# EAGLE design Datalore-IP-m4-rev02 (EAGLE 9.2.2)
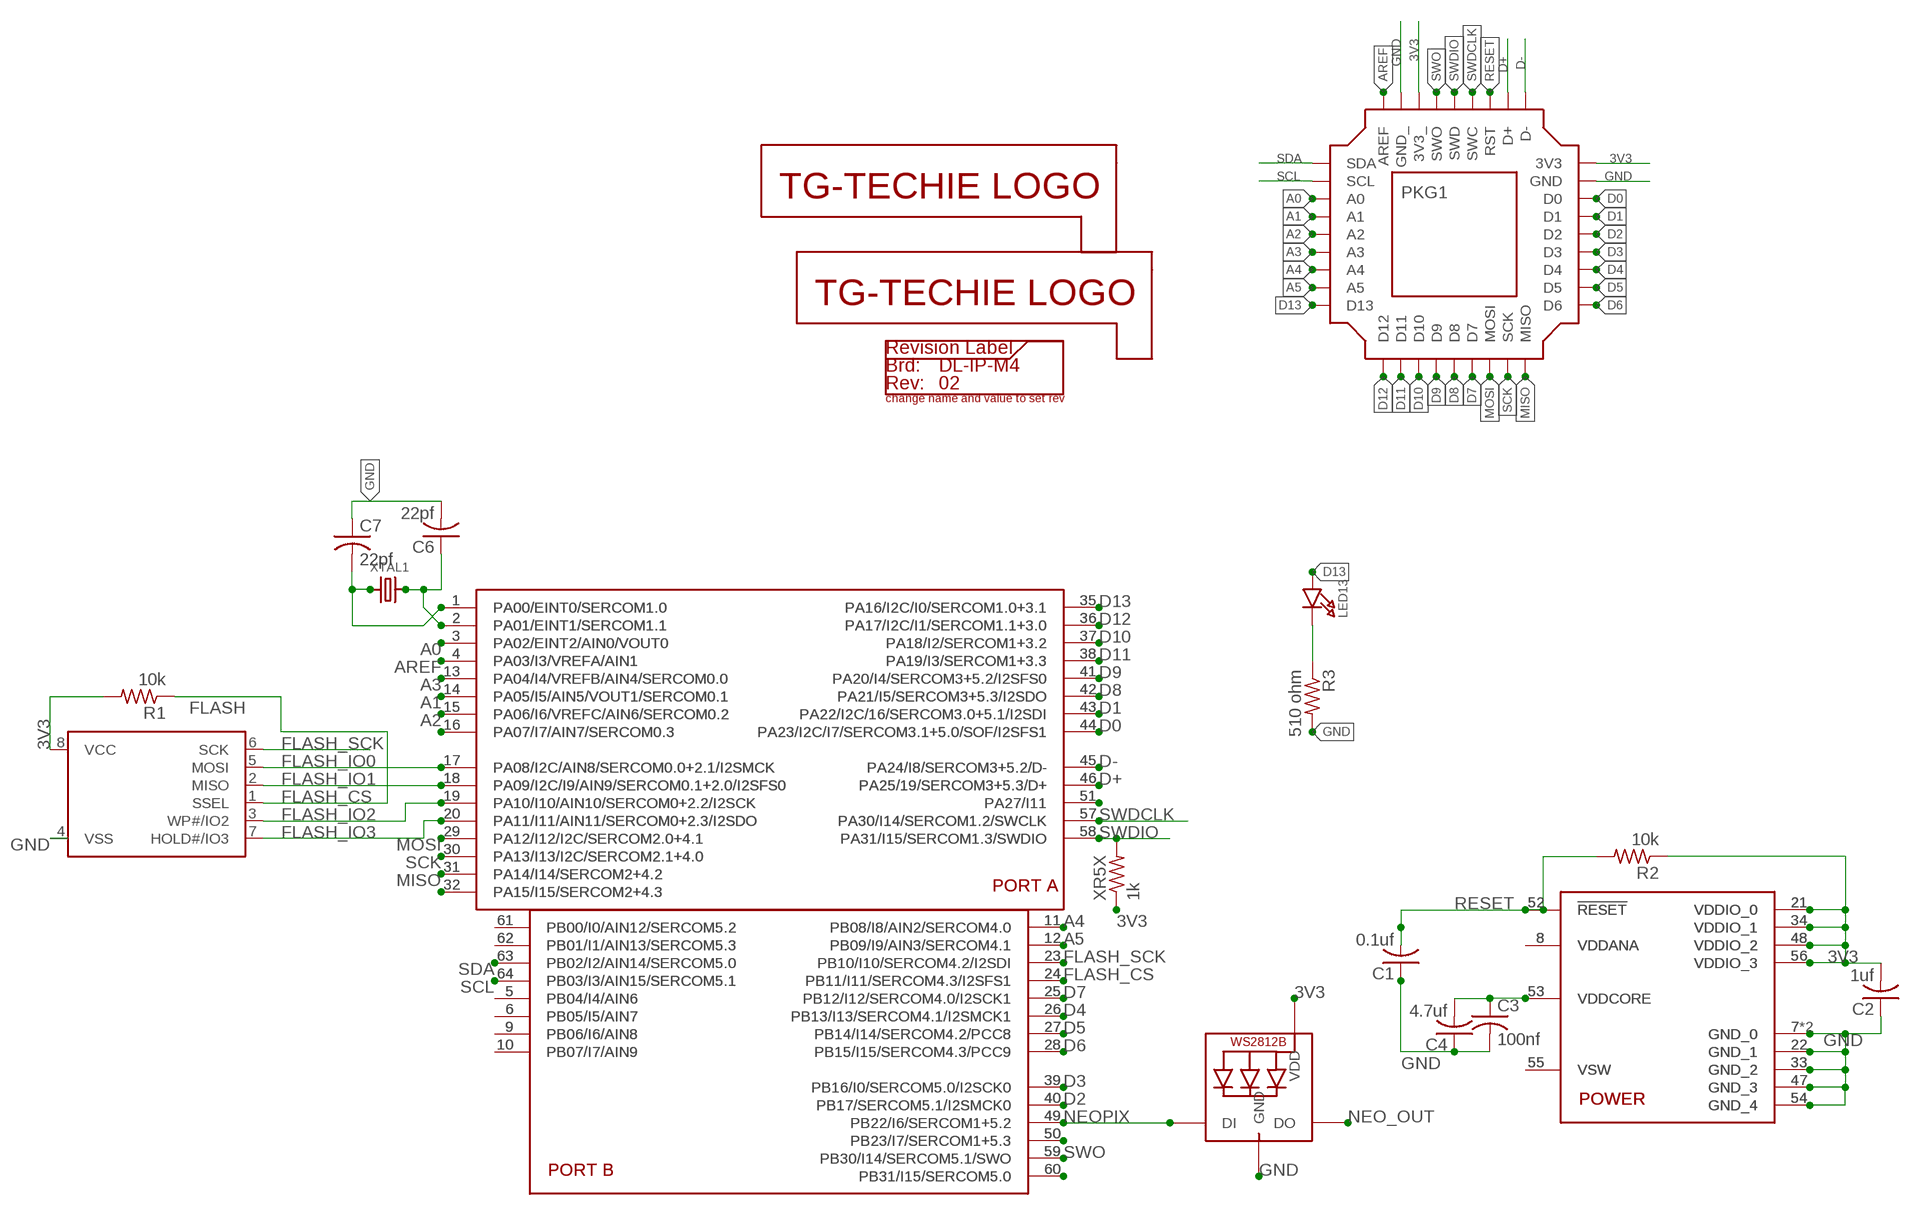
[diagram p0: schematic, sheet 1]

## Parts
..  MCU-ATSAMD51J-ADA+TG_TQFP  [QFP50P1200X1200X120-64N]
C1  0.1uf  C-TG_0603  [TG-0603]
C2  1uf  C-TG_0603  [TG-0603]
C3  100nf  C-TG_0603  [TG-0603]
C4  4.7uf  C-TG_0603  [TG-0603]
C6  22pf  C-TG_0603  [TG-0603]
C7  22pf  C-TG_0603  [TG-0603]
DL-IP-M4  02  REVISION_LABEL  [REVISION_LABEL]
FLASH  FLASH-SPI-CIRCUIT_PYTHON150MIL  [SOIC8_150MIL]
LED1  LED-NEO-WS2812B3535  [LED3535]
LED13  LED-MICROBUILDER1206_NOOUTLINE  [MICROBUILDER_CHIPLED_1206_NOOUTLINE]
PKG1  DATALORE_IP_M4PACKAGE  [DL_IP_36-100MIL-PACKAGE]
R1  10k  R_TG_0603  [TG-0603]
R2  10k  R_TG_0603  [TG-0603]
R3  510 ohm  R_TG_0603  [TG-0603]
U$1  LOGO-TG_TECHIEBIG?  [LOGO_TG_TEST_LARGE]
U$3  MCU-ATSAMD51J-ADA+TG_QFP_ADA  [MICROBUILDER_PQFN64-1]
U$5  LOGO-TG_TECHIEBIG?  [LOGO_TG_TEST_LARGE]
XR5X  1k  R_TG_0603  [TG-0603]
XTAL1  XTAL_ADA4.9X1.8  [MICROBUILDER_CRYSTAL_4.9X1.8]

## Nets
3V3: ...21(VDDIO_0) ...34(VDDIO_1) ...48(VDDIO_2) ...56(VDDIO_3) C2.2 FLASH.8(VCC) LED1.2(VDD) PKG1.3(3V3_) PKG1.10(3V3) R1.2 R2.1 U$3.21(VDDIO_0) U$3.34(VDDIO_1) U$3.48(VDDIO_2) U$3.56(VDDIO_3) XR5X.1
A0: ...3(PA02/EINT2/AIN0/VOUT0) PKG1.34(A0) U$3.3(PA02/EINT2/AIN0/VOUT0)
A1: ...14(PA05/I5/AIN5/VOUT1/SERCOM0.1) PKG1.33(A1) U$3.14(PA05/I5/AIN5/VOUT1/SERCOM0.1)
A2: ...15(PA06/I6/VREFC/AIN6/SERCOM0.2) PKG1.32(A2) U$3.15(PA06/I6/VREFC/AIN6/SERCOM0.2)
A3: ...13(PA04/I4/VREFB/AIN4/SERCOM0.0) PKG1.31(A3) U$3.13(PA04/I4/VREFB/AIN4/SERCOM0.0)
A4: ...11(PB08/I8/AIN2/SERCOM4.0) PKG1.30(A4) U$3.11(PB08/I8/AIN2/SERCOM4.0)
A5: ...12(PB09/I9/AIN3/SERCOM4.1) PKG1.29(A5) U$3.12(PB09/I9/AIN3/SERCOM4.1)
AREF: ...4(PA03/I3/VREFA/AIN1) PKG1.1(AREF) U$3.4(PA03/I3/VREFA/AIN1)
D0: ...44(PA23/I2C/I7/SERCOM3.1+5.0/SOF/I2SFS1) PKG1.12(D0) U$3.44(PA23/I2C/I7/SERCOM3.1+5.0/SOF/I2SFS1)
D1: ...43(PA22/I2C/16/SERCOM3.0+5.1/I2SDI) PKG1.13(D1) U$3.43(PA22/I2C/16/SERCOM3.0+5.1/I2SDI)
D2: ...40(PB17/SERCOM5.1/I2SMCK0) PKG1.14(D2) U$3.40(PB17/SERCOM5.1/I2SMCK0)
D3: ...39(PB16/I0/SERCOM5.0/I2SCK0) PKG1.15(D3) U$3.39(PB16/I0/SERCOM5.0/I2SCK0)
D4: ...26(PB13/I13/SERCOM4.1/I2SMCK1) PKG1.16(D4) U$3.26(PB13/I13/SERCOM4.1/I2SMCK1)
D5: ...27(PB14/I14/SERCOM4.2/PCC8) PKG1.17(D5) U$3.27(PB14/I14/SERCOM4.2/PCC8)
D6: ...28(PB15/I15/SERCOM4.3/PCC9) PKG1.18(D6) U$3.28(PB15/I15/SERCOM4.3/PCC9)
D7: ...25(PB12/I12/SERCOM4.0/I2SCK1) PKG1.22(D7) U$3.25(PB12/I12/SERCOM4.0/I2SCK1)
D8: ...42(PA21/I5/SERCOM3+5.3/I2SDO) PKG1.23(D8) U$3.42(PA21/I5/SERCOM3+5.3/I2SDO)
D9: ...41(PA20/I4/SERCOM3+5.2/I2SFS0) PKG1.24(D9) U$3.41(PA20/I4/SERCOM3+5.2/I2SFS0)
D10: ...37(PA18/I2/SERCOM1+3.2) PKG1.25(D10) U$3.37(PA18/I2/SERCOM1+3.2)
D11: ...38(PA19/I3/SERCOM1+3.3) PKG1.26(D11) U$3.38(PA19/I3/SERCOM1+3.3)
D12: ...36(PA17/I2C/I1/SERCOM1.1+3.0) PKG1.27(D12) U$3.36(PA17/I2C/I1/SERCOM1.1+3.0)
D13: ...35(PA16/I2C/I0/SERCOM1.0+3.1) LED13.A PKG1.28(D13) U$3.35(PA16/I2C/I0/SERCOM1.0+3.1)
D+: ...46(PA25/19/SERCOM3+5.3/D+) PKG1.8(D+) U$3.46(PA25/19/SERCOM3+5.3/D+)
D-: ...45(PA24/I8/SERCOM3+5.2/D-) PKG1.9(D-) U$3.45(PA24/I8/SERCOM3+5.2/D-)
FLASH_CS: ...24(PB11/I11/SERCOM4.3/I2SFS1) FLASH.1(SSEL) R1.1 U$3.24(PB11/I11/SERCOM4.3/I2SFS1)
FLASH_IO0: ...17(PA08/I2C/AIN8/SERCOM0.0+2.1/I2SMCK) FLASH.5(MOSI) U$3.17(PA08/I2C/AIN8/SERCOM0.0+2.1/I2SMCK)
FLASH_IO1: ...18(PA09/I2C/I9/AIN9/SERCOM0.1+2.0/I2SFS0) FLASH.2(MISO) U$3.18(PA09/I2C/I9/AIN9/SERCOM0.1+2.0/I2SFS0)
FLASH_IO2: ...19(PA10/I10/AIN10/SERCOM0+2.2/I2SCK) FLASH.3(WP#/IO2) U$3.19(PA10/I10/AIN10/SERCOM0+2.2/I2SCK)
FLASH_IO3: ...20(PA11/I11/AIN11/SERCOM0+2.3/I2SDO) FLASH.7(HOLD#/IO3) U$3.20(PA11/I11/AIN11/SERCOM0+2.3/I2SDO)
FLASH_SCK: ...23(PB10/I10/SERCOM4.2/I2SDI) FLASH.6(SCK) U$3.23(PB10/I10/SERCOM4.2/I2SDI)
GND: ...7(GND_0) ...22(GND_1) ...33(GND_2) ...47(GND_3) ...54(GND_4) C1.1 C2.1 C3.2 C4.1 C6.2 C7.1 FLASH.4(VSS) LED1.4(GND) PKG1.2(GND_) PKG1.11(GND) R3.2 U$3.7(GND_0) U$3.22(GND_1) U$3.33(GND_2) U$3.47(GND_3) U$3.54(GND_4) U$3.EXP(GND_0)
MISO: ...31(PA14/I14/SERCOM2+4.2) PKG1.19(MISO) U$3.31(PA14/I14/SERCOM2+4.2)
MOSI: ...29(PA12/I12/I2C/SERCOM2.0+4.1) PKG1.21(MOSI) U$3.29(PA12/I12/I2C/SERCOM2.0+4.1)
N$1: ...16(PA07/I7/AIN7/SERCOM0.3) U$3.16(PA07/I7/AIN7/SERCOM0.3)
N$2: ...32(PA15/I15/SERCOM2+4.3) U$3.32(PA15/I15/SERCOM2+4.3)
N$3: ...51(PA27/I11) U$3.51(PA27/I11)
N$4: LED13.C R3.1
N$5: ...8(VDDANA) U$3.8(VDDANA)
N$6: ...55(VSW) U$3.55(VSW)
N$7: ...61(PB00/I0/AIN12/SERCOM5.2) U$3.61(PB00/I0/AIN12/SERCOM5.2)
N$8: ...62(PB01/I1/AIN13/SERCOM5.3) U$3.62(PB01/I1/AIN13/SERCOM5.3)
N$9: ...5(PB04/I4/AIN6) U$3.5(PB04/I4/AIN6)
N$10: ...50(PB23/I7/SERCOM1+5.3) U$3.50(PB23/I7/SERCOM1+5.3)
N$11: ...60(PB31/I15/SERCOM5.0) U$3.60(PB31/I15/SERCOM5.0)
N$13: ...6(PB05/I5/AIN7) U$3.6(PB05/I5/AIN7)
N$14: ...9(PB06/I6/AIN8) U$3.9(PB06/I6/AIN8)
N$15: ...10(PB07/I7/AIN9) U$3.10(PB07/I7/AIN9)
NEO_OUT: LED1.3(DO)
NEOPIX: ...49(PB22/I6/SERCOM1+5.2) LED1.1(DI) U$3.49(PB22/I6/SERCOM1+5.2)
RESET: ...52(!RESET) C1.2 PKG1.7(RST) R2.2 U$3.52(!RESET)
SCK: ...30(PA13/I13/I2C/SERCOM2.1+4.0) PKG1.20(SCK) U$3.30(PA13/I13/I2C/SERCOM2.1+4.0)
SCL: ...64(PB03/I3/AIN15/SERCOM5.1) PKG1.35(SCL) U$3.64(PB03/I3/AIN15/SERCOM5.1)
SDA: ...63(PB02/I2/AIN14/SERCOM5.0) PKG1.36(SDA) U$3.63(PB02/I2/AIN14/SERCOM5.0)
SWDCLK: ...57(PA30/I14/SERCOM1.2/SWCLK) PKG1.6(SWC) U$3.57(PA30/I14/SERCOM1.2/SWCLK)
SWDIO: ...58(PA31/I15/SERCOM1.3/SWDIO) PKG1.5(SWD) U$3.58(PA31/I15/SERCOM1.3/SWDIO) XR5X.2
SWO: ...59(PB30/I14/SERCOM5.1/SWO) PKG1.4(SWO) U$3.59(PB30/I14/SERCOM5.1/SWO)
VCORE: ...53(VDDCORE) C3.1 C4.2 U$3.53(VDDCORE)
XTAL0: ...2(PA01/EINT1/SERCOM1.1) C6.1 U$3.2(PA01/EINT1/SERCOM1.1) XTAL1.2
XTAL1: ...1(PA00/EINT0/SERCOM1.0) C7.2 U$3.1(PA00/EINT0/SERCOM1.0) XTAL1.1

## Library data of the parts
.. U$3 = 0TG-Lib v01.4:MCU-ATSAMD51J-ADA+TG: ATSAMD51J cortex m4 microcontroller from: adafruit altered: TG-Techie
C1-C4 C6 C7 = 0TG-Lib v01.4:C-TG
DL-IP-M4 = 0TG-Lib v01.4:REVISION_LABEL
FLASH = 0TG-Lib v01.4:FLASH-SPI-CIRCUIT_PYTHON: SOIC8 SPI Flash Be careful with the size since SOIC8 flash comes in several 'widths' SOIC8 150 mil M25P16 - 16Mbit (2Mbit x 8) Serial Flash (75MHz SPI Bus), Supply: 2.7-3.6V Digikey: SOIC8 - M25P16-VMN6P-ND SOIC8 208 mil W25Q16BVSSIG - 16Mbit (2Mbit x 8) Serial Flash (104MHz SPI Bus), Supply: 2.7-3.6V Digikey: SOIC8 - W25Q16BVSSIG-ND from: adafruit availability low
LED1 = 0TG-Lib v01.3:LED-NEO-WS2812B: from: adafruit
LED13 = 0TG-Lib v01.4:LED-MICROBUILDER: from: microbuilder LED 0603 - 0603 Surface Mount Package 2mA: Green LED - Low Power (3.9mcd, 2ma, 1.7Vf) - Digikey: 475-2709-2-ND Orange LED - Low Power (9.8mcd, 2ma, 1.8Vf) - Digikey: 475-1194-2-ND Red LED - Low Power (5mcd, 2ma, 1.8Vf) - Digikey: 475-1195-2-ND Yellow LED - Low Power (7mcd, 2ma, 1.8Vf) - Digikey: 475-1196-2-ND 5mA: Blue LED - Low Power (17mcd, 5ma, 2.9Vf) - Digikey: LNJ937W8CRACT-ND 0805 - 0805 Surface Mount Package 2mA: Red LED (8.8mcd, 2mA, 1.8Vf, Clear) - Low Power [Digikey: 475-2510-1-ND] Green LED (5mcd, 2mA, 1.8Vf, Clear) - Low Power [Digikey: 475-2730-1-ND] Yellow LED (11.3mcd, 2mA, 1.8Vf, Clear) - Low Power [Digikey: 475-2555-1-ND] 20mA: Red LED (104mcd, 20mA, Diffused) - LS R976 [Digikey: 475-1278-6-ND] Red LED (12mcd, 20mA, 2.0Vf, Clear) - APT2012EC [Digikey: 754-1128-1-ND] Green LED (15mcd, 20mA, 2.2Vf, Clear) - APT2012GC [Digikey: 754-1131-1-ND] Orange LED (160mcd, 20mA, 2.1Vf, Clear) - APT2012SECK [Digikey: 754-1130-1-ND] 1206 - 1206 Surface Mount Package Green LED (26mcd, 20mA, Diffused) - LG N971 [Digikey: 475-1407-6-ND] Red LED (15mcd, 20mA, Diffused) - LH N974 [Digikey: 475-1416-6-ND] Cree - Cree High-Power Surface Mount LEDs XPEBWT-L1-0000-00D50 - White 111lm 350mA 2.9Vf 6200K 110° XTEAWT-00-0000-00000LEE3 - White 114lm 350mA 2.85Vf 5000K 115° Everlight - Everlight 45-21 Series Surface Mount LEDs 45-21/QK2C-B2832AC2CB2/2T - Warm White 2000mcd 20mA 3.25Vf 3050K 120° 45-21/LK2C-B38452C4CB2/2T - Nuetral White 2000mcd 20mA 3.25Vf 4150K 120° 45-21/LK2C-B50634C6CB2/2T - Cold White 2200mcd 20mA 3.25Vf 5650K 120° PLCC2 Reverse Mount LS T77K-J1L2-1-0-2-R18-Z - Red 11.25mcd 2mA 1.8Vf 630nm 120° LO T77K-L1M2-24-Z - Orange 19.6mcd 2mA 1.8Vf 606nm 120° LY T77K-K2M1-26-Z - Yellow 15.7mcd 2mA 1.8Vf 587nm 120°
PKG1 = Datalore dev lib:DATALORE_IP_M4
R1-R3 XR5X = 0TG-Lib v01.4:R_TG
U$1 U$5 = 0TG-Lib v01.4:LOGO-TG_TECHIE
XTAL1 = 0TG-Lib v01.4:XTAL_ADA: Crystals HC49UP - Surface Mount Crystal 4.0MHz 18pF +/-30ppm Surface Mount Crystal [Digikey: 535-9857-1-ND] 12.0 MHz Surface Mount Crystal [Digikey: 535-9869-6-ND] 25.0 MHz Surface Mount Crystal [Digikey: 535-9078-1-ND] 2.5 x 2.0mm - MEMs SMT Crystal 16.0 MHz 10pF 20ppm 2.5 x 2.0mm Crystal [Digikey -40-85°C: 535-10923-1-ND] 3.2 x 2.5mm - MEMs SMT Crystal 12.0 MHz 8pF 15ppm 3.2 x 2.5mm Crystal [Digikey: -10-70°C: 644-1047-1-ND -40-125°C: 644-1128-1-ND] 16.0 MHz 8pF 15ppm 3.2 x 2.5mm Crystal [Digikey: -10-70°C: 644-1049-1-ND -40-125°C: 644-1129-2-ND] 16.0 MHz 10pF 10ppm 3.2 x 2.5mm Crystal [Digikey: 644-1100-1-ND] 27.12 MHz 18pF 30ppm 3.2 x 2.5mm Crystal [Digikey: 887-1424-1-ND] 27.12MHz 10pF 10ppm 3.2 x 2.5mm Crystal [Digikey: 887-1329-1-ND] 4.9 x 1.8mm - MEMs SMT Crystal 32.768 KHz 12.5pF 20ppm 4.9 x 1.8mm Crystal [Digikey: SE2415CT-ND] 8.0 x 3.8mm - Surface Mount Crystal 32.768kHz 12.5pF 20ppm -40°C-85°C [Digikey: 535-9166-2-ND] Cylinder 32.768KHz Cylinder Crystal (2x6mm body) [Ex. Digikey: 300-8341-2-ND]

## Board
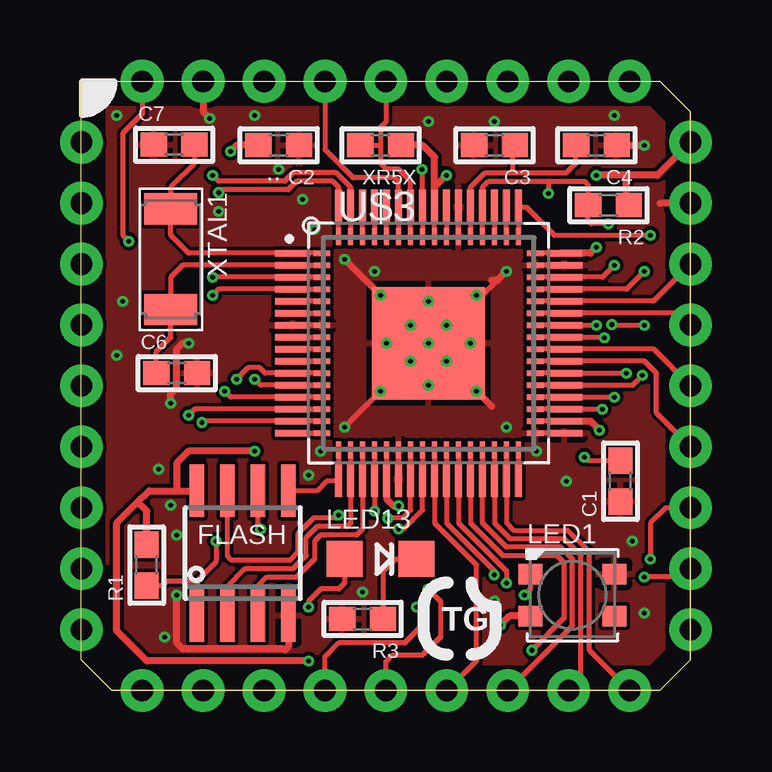
[diagram p1: board, top side]
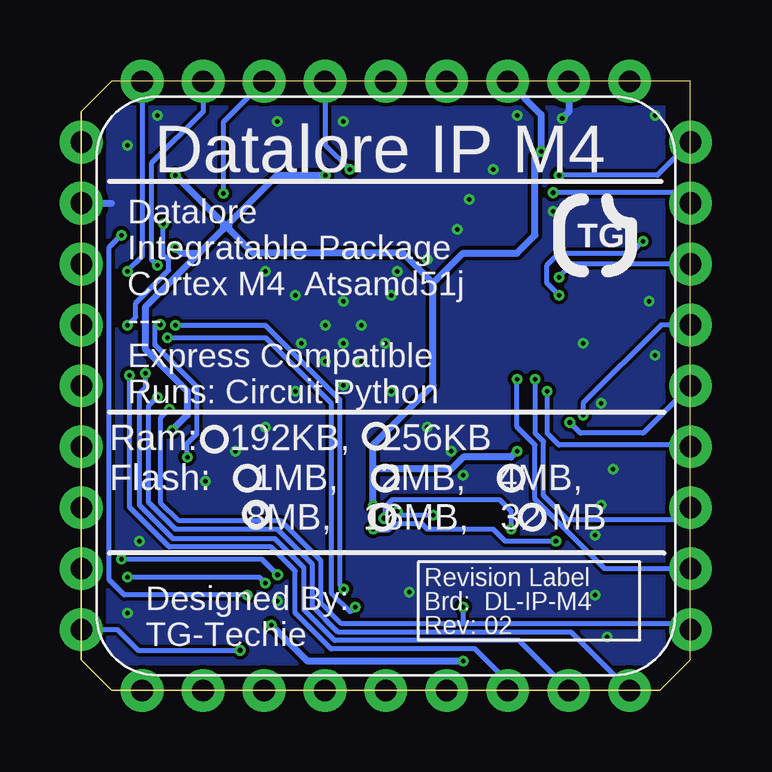
[diagram p2: board, bottom side, seen from below]

Size 25.4 x 25.4 mm. Coordinates in mm from the lower left corner, seen from the top.
Outline: 0,1.27 1.27,0 24.13,0 25.4,1.27 25.4,24.13 24.13,25.4
Copper layers (1*16): Top 0.035mm / dielectric 0.53mm / Bottom 0.035mm
Design rules "tg jlc-special via": minimum track width 0.195mm, minimum drill 0.2mm, track to track 6mil, track to pad 6mil, pad to pad 6mil, via to via 6mil, smd to smd 6mil, copper to edge 40mil, drill to drill 6mil, minimum pad ring 10mil, minimum via ring 0.125mm, stop-mask expansion 4mil, vias tented up to drill 10000mil, thermal gap 10mil

### Footprints (pad centres in the part's own frame; a part is rotated, then mirrored left to right if it is on the bottom)
QFP50P1200X1200X120-64N = smd 1.47 x 0.28: 1 -5.67,3.75; 2 -5.67,3.25; 3 -5.67,2.75; 4 -5.67,2.25; 5 -5.67,1.75; 6 -5.67,1.25; 7 -5.67,0.75; 8 -5.67,0.25; 9 -5.67,-0.25; 10 -5.67,-0.75; 11 -5.67,-1.25; 12 -5.67,-1.75; 13 -5.67,-2.25; 14 -5.67,-2.75; 15 -5.67,-3.25; 16 -5.67,-3.75; 33 5.67,-3.75; 34 5.67,-3.25; 35 5.67,-2.75; 36 5.67,-2.25; 37 5.67,-1.75; 38 5.67,-1.25; 39 5.67,-0.75; 40 5.67,-0.25; 41 5.67,0.25; 42 5.67,0.75; 43 5.67,1.25; 44 5.67,1.75; 45 5.67,2.25; 46 5.67,2.75; 47 5.67,3.25; 48 5.67,3.75 | smd 0.28 x 1.47: 17 -3.75,-5.67; 18 -3.25,-5.67; 19 -2.75,-5.67; 20 -2.25,-5.67; 21 -1.75,-5.67; 22 -1.25,-5.67; 23 -0.75,-5.67; 24 -0.25,-5.67; 25 0.25,-5.67; 26 0.75,-5.67; 27 1.25,-5.67; 28 1.75,-5.67; 29 2.25,-5.67; 30 2.75,-5.67; 31 3.25,-5.67; 32 3.75,-5.67; 49 3.75,5.67; 50 3.25,5.67; 51 2.75,5.67; 52 2.25,5.67; 53 1.75,5.67; 54 1.25,5.67; 55 0.75,5.67; 56 0.25,5.67; 57 -0.25,5.67; 58 -0.75,5.67; 59 -1.25,5.67; 60 -1.75,5.67; 61 -2.25,5.67; 62 -2.75,5.67; 63 -3.25,5.67; 64 -3.75,5.67
TG-0603 = smd 1.1 x 1: 1 -0.85,0; 2 0.85,0
SOIC8_150MIL = smd 0.6 x 2.2: 1 -1.905,-2.6; 2 -0.635,-2.6; 3 0.635,-2.6; 4 1.905,-2.6; 5 1.905,2.6; 6 0.635,2.6; 7 -0.635,2.6; 8 -1.905,2.6
LED3535 = smd 1 x 0.85: 1 -1.75,0.875; 2 -1.75,-0.875; 3 1.75,-0.875; 4 1.75,0.875
MICROBUILDER_CHIPLED_1206_NOOUTLINE = smd 1.5 x 1.5: A 0,-1.496; C 0,1.496
DL_IP_36-100MIL-PACKAGE = drill 0.9 pad 1.778: 1 -10.16,12.7; 2 -7.62,12.7; 3 -5.08,12.7; 4 -2.54,12.7; 5 0,12.7; 6 2.54,12.7; 7 5.08,12.7; 8 7.62,12.7; 9 10.16,12.7; 10 12.7,10.16; 11 12.7,7.62; 12 12.7,5.08; 13 12.7,2.54; 14 12.7,0; 15 12.7,-2.54; 16 12.7,-5.08; 17 12.7,-7.62; 18 12.7,-10.16; 19 10.16,-12.7; 20 7.62,-12.7; 21 5.08,-12.7; 22 2.54,-12.7; 23 0,-12.7; 24 -2.54,-12.7; 25 -5.08,-12.7; 26 -7.62,-12.7; 27 -10.16,-12.7; 28 -12.7,-10.16; 29 -12.7,-7.62; 30 -12.7,-5.08; 31 -12.7,-2.54; 32 -12.7,0; 33 -12.7,2.54; 34 -12.7,5.08; 35 -12.7,7.62; 36 -12.7,10.16
MICROBUILDER_PQFN64-1 = smd 0.7 x 0.22: 1 -4.45,3.75; 2 -4.45,3.25; 3 -4.45,2.75; 4 -4.45,2.25; 5 -4.45,1.75; 6 -4.45,1.25; 7 -4.45,0.75; 8 -4.45,0.25; 9 -4.45,-0.25; 10 -4.45,-0.75; 11 -4.45,-1.25; 12 -4.45,-1.75; 13 -4.45,-2.25; 14 -4.45,-2.75; 15 -4.45,-3.25; 16 -4.45,-3.75; 33 4.45,-3.75; 34 4.45,-3.25; 35 4.45,-2.75; 36 4.45,-2.25; 37 4.45,-1.75; 38 4.45,-1.25; 39 4.45,-0.75; 40 4.45,-0.25; 41 4.45,0.25; 42 4.45,0.75; 43 4.45,1.25; 44 4.45,1.75; 45 4.45,2.25; 46 4.45,2.75; 47 4.45,3.25; 48 4.45,3.75 | smd 0.22 x 0.7: 17 -3.75,-4.45; 18 -3.25,-4.45; 19 -2.75,-4.45; 20 -2.25,-4.45; 21 -1.75,-4.45; 22 -1.25,-4.45; 23 -0.75,-4.45; 24 -0.25,-4.45; 25 0.25,-4.45; 26 0.75,-4.45; 27 1.25,-4.45; 28 1.75,-4.45; 29 2.25,-4.45; 30 2.75,-4.45; 31 3.25,-4.45; 32 3.75,-4.45; 49 3.75,4.45; 50 3.25,4.45; 51 2.75,4.45; 52 2.25,4.45; 53 1.75,4.45; 54 1.25,4.45; 55 0.75,4.45; 56 0.25,4.45; 57 -0.25,4.45; 58 -0.75,4.45; 59 -1.25,4.45; 60 -1.75,4.45; 61 -2.25,4.45; 62 -2.75,4.45; 63 -3.25,4.45; 64 -3.75,4.45 | smd 4.7 x 4.7: EXP 0,0
MICROBUILDER_CRYSTAL_4.9X1.8 = smd 1.3 x 2.2: 1 -2.1,0; 2 2.1,0

### Placement (x,y rotation side)
..  14.48,14.48 0 top
C1  22.48,8.73 90 top
C2  8.23,22.73 180 top
C3  17.23,22.73 180 top
C4  21.48,22.73 180 top
C6  3.98,13.23 0 top
C7  3.87,22.75 0 top
DL-IP-M4  11.11,5.11 0 bottom
FLASH  6.73,5.73 0 top
LED1  20.48,3.98 0 top
LED13  12.48,5.48 270 top
PKG1  12.7,12.7 0 top
R1  2.73,5.23 90 top
R2  21.98,20.23 180 top
R3  11.73,2.98 180 top
U$1  3.98,17.48 0 bottom
U$3  14.48,14.48 0 top
U$5  15.77,1.5 0 top
XR5X  12.48,22.73 180 top
XTAL1  3.73,17.98 270 top

### Tracks (layer width: path | path; a pad name or v marks a point on that pad's centre or on a via)
3V3  (via drill 0.2 pad 0.12)
  Top 0.2: U$3.21 ...21 | ...48 19.98,18.23 U$3.48 | U$3.56 ...56 | ...34 U$3.34
  Top 0.3: ...34 21.23,11.23 v21.61,10.86 | ...21 12.73,7.98 13.01,7.7 v13.23,7.7 | LED1.2 17.86,3.1 v17.48,2.73 | v9.48,1.23 2.73,1.23 1.48,2.48 1.48,6.98 2.35,7.86 | 2.35,7.86 2.83,8.33 3.98,8.33 | ...56 14.73,20.98 | 14.73,20.98 v15.23,21.48 | 14.73,20.98 14.73,22.23 14.23,22.73 XR5X.1 | PKG1.10 24.02,21.48 22.73,21.48 | 22.73,21.48 v21.48,21.48 | R2.1 22.73,20.33 22.73,21.48 | C2.2 6.48,22.73 v6.23,22.48 | R1.2 2.73,7.48 2.35,7.86 | 3.98,8.33 FLASH.8 | v7.23,9.98 4.48,9.98 3.98,9.48 3.98,8.33 | v21.48,18.48 21.23,18.23 19.98,18.23
  Bottom 0.3: v21.61,10.86 20.98,11.48 20.98,12.48 22.73,14.23 22.73,15.98 20.48,18.23 | v17.48,2.73 15.98,1.23 v9.48,1.23 | v15.23,21.48 17.23,21.48 19.23,19.48 | 10.73,16.98 11.98,18.23 18.23,18.23 19.23,19.23 19.23,19.48 | 10.73,16.98 9.48,18.23 7.23,18.23 6.48,18.98 6.48,22.23 v6.23,22.48 6.23,24.01 PKG1.3 | v13.23,7.7 13.23,9.23 | 13.23,9.23 13.23,10.23 10.73,12.73 10.73,16.98 | 13.23,9.23 9.98,9.23 9.48,9.73 7.48,9.73 v7.23,9.98 | v21.48,18.48 21.23,18.23 20.48,18.23 | 20.48,18.23 19.48,19.23 | 19.48,19.23 19.23,19.48 | v21.48,21.48 19.48,19.48 19.48,19.23
A0  (via drill 0.2 pad 0.12)
  Top 0.2: U$3.3 ...3 v5.48,17.23
  Bottom 0.2: PKG1.34 4.93,17.78 v5.48,17.23
A1  (via drill 0.2 pad 0.12)
  Top 0.2: U$3.14 ...14 4.73,11.73 v4.48,11.48
  Bottom 0.2: PKG1.33 1.22,15.24 4.48,11.98 v4.48,11.48
A2  (via drill 0.2 pad 0.12)
  Top 0.2: U$3.15 ...15 5.08,11.23 v5.03,11.18
  Bottom 0.2: v5.03,11.18 4.58,10.73 1.97,10.73 PKG1.32
A3  (via drill 0.2 pad 0.12)
  Top 0.2: U$3.13 ...13 6.23,12.23 v5.98,12.48
  Bottom 0.2: v5.98,12.48 5.98,10.73 5.48,10.23 0.07,10.23 PKG1.31
A4  (via drill 0.2 pad 0.12)
  Top 0.2: U$3.11 ...11 7.66,13.23 7.43,13.46 6.96,13.46 v6.48,12.98
  Bottom 0.2: v6.48,12.98 6.48,10.73 6.13,10.38 6.13,8.13 5.12,7.12 0.5,7.12 PKG1.30
A5  (via drill 0.2 pad 0.12)
  Top 0.2: U$3.12 ...12 7.48,12.73 v7.23,12.98
  Bottom 0.2: PKG1.29 3.58,5.08 6.48,7.98 6.48,10.23 7.23,10.98 v7.23,12.98
AREF  (via drill 0.2 pad 0.12)
  Top 0.2: U$3.4 ...4 5.73,16.73 v5.48,16.48 | v1.98,18.73 1.73,18.98 1.73,23.23 2.54,24.04 PKG1.1
  Bottom 0.2: v5.48,16.48 5.98,16.98 5.98,17.73 5.48,18.23 2.48,18.23 v1.98,18.73
D0
  Top 0.2: U$3.44 ...44 23.85,16.23 PKG1.12
D1
  Top 0.2: U$3.43 ...43 24.91,15.73 PKG1.13
D2
  Top 0.2: U$3.40 ...40 23.87,14.23 PKG1.14
D3
  Top 0.2: U$3.39 ...39 23.48,13.73 23.98,13.23 23.98,11.58 PKG1.15
D4  (via drill 0.2 pad 0.12)
  Top 0.2: U$3.26 ...26 15.23,6.99 17.22,5 v17.22,4.82 | PKG1.16 24.37,7.62 23.73,6.98 v23.73,5.48
  Bottom 0.2: v23.73,5.48 17.88,5.48 v17.22,4.82
D5  (via drill 0.2 pad 0.12)
  Top 0.2: v17.73,4.48 17.73,4.98 15.73,6.98 ...27 U$3.27 | PKG1.17 25.05,4.73 v23.48,4.73
  Bottom 0.2: v23.48,4.73 17.98,4.73 v17.73,4.48
D6  (via drill 0.2 pad 0.12)
  Top 0.2: U$3.28 ...28 16.23,6.98 17.58,5.63 19.83,5.63 20.13,5.33 20.13,3.02 v18.78,1.68
  Bottom 0.2: v18.78,1.68 23.04,1.68 23.9,2.54 PKG1.18
D7
  Top 0.2: U$3.25 ...25 14.73,6.99 16.48,5.24 16.48,1.24 PKG1.22
D8  (via drill 0.2 pad 0.12)
  Top 0.2: U$3.42 ...42 v21.48,15.23 | v14.46,4.23 14.98,3.71 14.98,2.23 14.23,1.48 12.98,1.48 12.7,1.2 PKG1.23
  Bottom 0.2: v21.48,15.23 17.73,15.23 14.63,12.13 14.63,4.4 v14.46,4.23
D9  (via drill 0.2 pad 0.12)
  Top 0.2: U$3.41 ...41 21.79,14.73 v21.81,14.71 | PKG1.24 10.16,1.41 10.73,1.98 13.48,1.98 14.11,2.6 14.11,3.35 v13.98,3.48
  Bottom 0.2: v21.81,14.71 17.71,14.71 14.98,11.98 14.98,4.08 14.18,3.28 v13.98,3.48
D10  (via drill 0.2 pad 0.12)
  Top 0.2: U$3.37 ...37 22.98,12.73 v23.39,13.14
  Bottom 0.2: PKG1.25 7.62,0.37 8.98,1.73 14.98,1.73 16.48,3.23 16.48,4.98 17.48,5.98 21.73,5.98 23.39,7.64 v23.39,13.14
D11  (via drill 0.2 pad 0.12)
  Top 0.2: U$3.38 ...38 v22.73,13.23
  Bottom 0.2: PKG1.26 7.16,2.08 14.83,2.08 16.13,3.38 16.13,5.13 17.33,6.33 21.58,6.33 22.98,7.73 22.98,12.36 22.73,12.61 v22.73,13.23
D12  (via drill 0.2 pad 0.12)
  Top 0.2: U$3.36 ...36 v22.23,12.23
  Bottom 0.2: PKG1.27 4.97,2.44 14.69,2.44 15.78,3.52 15.78,5.27 17.23,6.73 21.48,6.73 22.61,7.85 22.61,11.86 v22.23,12.23
D13  (via drill 0.2 pad 0.12)
  Top 0.2: U$3.35 ...35 v21.73,11.73 | LED13.A 10.98,4.48 10.73,4.23 9.98,4.23 9.48,3.73 v9.48,3.48
  Bottom 0.2: PKG1.28 0.25,2.79 9.48,2.79 | 9.48,2.79 14.54,2.79 15.42,3.67 15.42,5.42 17.09,7.08 21.34,7.08 22.11,7.85 22.11,11.36 v21.73,11.73 | v9.48,3.48 9.48,2.79
D+  (via drill 0.2 pad 0.12)
  Top 0.2: U$3.46 ...46 21.73,17.23 v22.23,17.73
  Bottom 0.2: v22.23,17.73 22.48,17.98 22.48,21.98 20.32,24.14 PKG1.8
D-  (via drill 0.2 pad 0.12)
  Top 0.2: U$3.45 ...45 22.73,16.73 v23.48,17.48
  Bottom 0.2: v23.48,17.48 22.86,18.1 PKG1.9
FLASH_CS  (via drill 0.2 pad 0.12)
  Top 0.2: U$3.24 ...24 14.23,7.52 13.45,6.74 v13.23,6.74 | v5.62,6.23 5.62,5.37 4.82,4.57 | 4.82,4.57 FLASH.1 | R1.1 3.38,4.38 3.57,4.57 4.82,4.57
  Bottom 0.2: v13.23,6.74 13.19,6.7 12.58,6.7 12.33,6.96 11.21,6.96 10.98,6.73 8.23,6.73 7.73,6.23 v5.62,6.23
FLASH_IO0
  Top 0.2: U$3.17 ...17 10.65,8.73 10.23,8.73 9.83,8.33 FLASH.5
FLASH_IO1
  Top 0.2: U$3.18 ...18 11.23,6.98 11.09,6.84 9.84,6.84 9.38,6.38 9.38,5.63 8.83,5.08 6.83,5.08 6.1,4.35 FLASH.2
FLASH_IO2
  Top 0.2: U$3.19 ...19 11.73,6.73 11.48,6.48 10.13,6.48 9.98,6.48 9.73,6.23 9.73,5.48 8.98,4.73 7.73,4.73 7.37,4.37 FLASH.3
FLASH_IO3  (via drill 0.2 pad 0.12)
  Top 0.2: U$3.20 ...20 v12.23,7.48 | v10.73,7.31 10.61,7.19 9.69,7.19 9.03,6.52 9.03,5.77 8.69,5.44 6.28,5.44 6.1,5.62 FLASH.7
  Bottom 0.2: v12.23,7.48 12.06,7.31 v10.73,7.31
FLASH_SCK  (via drill 0.2 pad 0.12)
  Top 0.2: U$3.23 ...23 13.73,7.52 13.43,7.22 12.82,7.22 v12.78,7.18 | v7.48,6.73 7.37,6.85 FLASH.6
  Bottom 0.2: v12.78,7.18 12.71,7.25 12.71,7.68 12.43,7.96 7.96,7.96 7.48,7.48 v7.48,6.73
GND  (via drill 0.2 pad 0.12)
  Top 0.2: U$3.22 ...22 | U$3.7 ...7 | ...47 U$3.47 | ...33 U$3.33 | U$3.54 ...54 | v17.73,17.48 12.73,12.48 v12.48,12.48 | U$3.EXP v10.98,10.98
  Top 0.3: PKG1.11 24.14,20.32 | FLASH.4 8.63,1.84 8.48,1.68 8.43,1.73 7.79,1.73 4.4,1.73 4.23,1.73 3.98,1.98 v3.98,3.98 | C4.1 v23.48,22.73 | v3.73,11.98 3.73,12.35 3.98,12.61 3.98,13.86 3.98,14.23 4.23,14.48 v4.48,14.48 | v10.98,17.98 17.11,11.86 | v17.73,17.48 17.36,17.11 17.11,17.11 | PKG1.2 5.08,24.13 v5.36,23.86
  Bottom 0.3: PKG1.11 24.14,20.32 | PKG1.2 5.08,24.13 v5.36,23.86
  other vias: 17.73,10.98 12.23,17.48 9.73,19.23 12.48,16.48 16.48,12.48 16.48,16.48 12.73,14.48 14.48,16.23 13.73,15.23 13.73,13.73 15.23,13.73 15.23,15.23 14.48,14.48 16.23,14.48 14.48,12.73 18.98,9.98 17.23,3.73 23.48,3.23 22.98,6.23 20.23,8.73 22.23,23.98 17.23,23.73 14.48,23.73 8.23,21.73 5.73,19.98 3.73,7.73 7.23,23.98 9.23,20.48 9.48,8.98 9.98,9.98 3.23,9.23 1.48,13.98 1.73,16.23 3.98,6.48 3.48,2.23 11.73,4.11 1.48,23.98
  pour Top: -1.4,26.61 -1.4,-1.27 26.61,-1.27 26.61,26.61
  pour Bottom: 27.11,27.11 -1.9,27.11 -1.9,-1.65 27.11,-1.65
MISO
  Top 0.2: U$3.31 ...31 17.73,6.98 18.02,6.69 20.27,6.69 21.18,5.77 21.18,1.67 PKG1.19
MOSI
  Top 0.2: U$3.29 ...29 16.73,6.98 17.73,5.98 19.98,5.98 20.48,5.48 20.48,2.7 PKG1.21
N$1
  Top 0.2: ...16 U$3.16
N$2
  Top 0.2: U$3.32 ...32
N$3
  Top 0.2: ...51 U$3.51
N$4
  Top 0.2: LED13.C 13.1,5.48 12.58,4.96 R3.1
N$5
  Top 0.2: ...8 U$3.8
N$6
  Top 0.2: ...55 U$3.55
N$7
  Top 0.2: ...61 U$3.61
N$8
  Top 0.2: U$3.62 ...62
N$9
  Top 0.2: U$3.5 ...5
N$10
  Top 0.2: U$3.50 ...50
N$11
  Top 0.2: U$3.60 ...60
N$13
  Top 0.2: ...6 U$3.6
N$14
  Top 0.2: U$3.9 ...9
N$15
  Top 0.2: ...10 U$3.10
NEOPIX  (via drill 0.2 pad 0.12)
  Top 0.2: U$3.49 ...49 18.56,20.15 19.73,18.98 v23.73,18.98 | LED1.1 18.73,4.23 v18.48,3.98
  Bottom 0.2: v23.73,18.98 24.23,18.48 24.23,4.61 23.61,3.98 v18.48,3.98
RESET  (via drill 0.2 pad 0.12)
  Top 0.2: U$3.52 ...52 16.73,20.98 16.98,21.23 19.48,21.23 | 19.48,21.23 20.98,21.23 21.13,21.08 R2.2 21.13,19.58 21.25,19.46 v21.98,19.46 | 19.48,21.23 v19.48,20.73 | C1.2 21.13,9.58 v20.98,9.73 | v22.12,15.25 22.14,15.23 v23.48,15.23
  Bottom 0.2: v19.48,20.73 19.48,23.7 PKG1.7 | v20.98,9.73 20.98,10.3 20.58,10.71 20.58,12.65 22.33,14.4 22.33,15.23 22.14,15.23 v22.12,15.25 | v23.48,15.23 23.13,15.58 23.13,16.15 21.75,17.53 21.75,17.93 21.98,18.16 v21.98,19.46
SCK
  Top 0.2: U$3.30 ...30 17.23,6.98 17.88,6.33 20.13,6.33 20.83,5.63 20.83,0.51 PKG1.20
SCL  (via drill 0.2 pad 0.12)
  Top 0.2: U$3.64 ...64 10.73,20.98 10.48,21.23 8.98,21.23 8.63,20.88 5.86,20.88 v5.73,20.75
  Bottom 0.2: PKG1.35 0.43,20.75 v5.73,20.75
SDA  (via drill 0.2 pad 0.12)
  Top 0.2: U$3.63 ...63 11.23,20.98 10.63,21.58 8.83,21.58 8.48,21.23 5.73,21.23 v5.48,21.48
  Bottom 0.2: PKG1.36 1.38,21.48 v5.48,21.48
SWDCLK  (via drill 0.2 pad 0.12)
  Top 0.2: U$3.57 ...57 14.23,21.7 v14.2,21.73
  Bottom 0.2: v14.2,21.73 15.24,22.77 PKG1.6
SWDIO
  Top 0.2: U$3.58 ...58 13.73,21.23 13.23,21.73 12.73,21.73 12.48,21.98 12.48,22.73 | 12.48,22.73 12.48,23.48 12.7,23.7 PKG1.5 | XR5X.2 12.48,22.73
SWO
  Top 0.2: U$3.59 ...59 13.23,21.23 13.08,21.38 11.33,21.38 10.16,22.55 PKG1.4
VCORE
  Top 0.2: U$3.53 ...53 16.23,20.98 16.83,21.58 17.98,21.58 | 17.98,21.58 20.23,21.58 20.63,21.98 C4.2 | C3.1 17.98,22.63 17.98,21.58
XTAL0
  Top 0.2: U$3.2 ...2 4.23,17.73 3.73,17.23 XTAL1.2 3.73,14.73 3.13,14.13 C6.1
XTAL1
  Top 0.2: U$3.1 ...1 4.48,18.23 3.73,18.98 XTAL1.1 3.73,20.98 4.72,21.97 C7.2

### Text on the board
bPlace: Datalore IP M4 | Datalore / Integratable Package / Cortex M4 Atsamd51j / --- / Express Compatible / Runs: Circuit Python | Ram: 192KB, 256KB / Flash: 1MB, 2MB, 4MB, / 8MB, 16MB, 32 MB | Designed By: / TG-Techie